# EAGLE schematic mod_mixer (EAGLE 7.2.0)
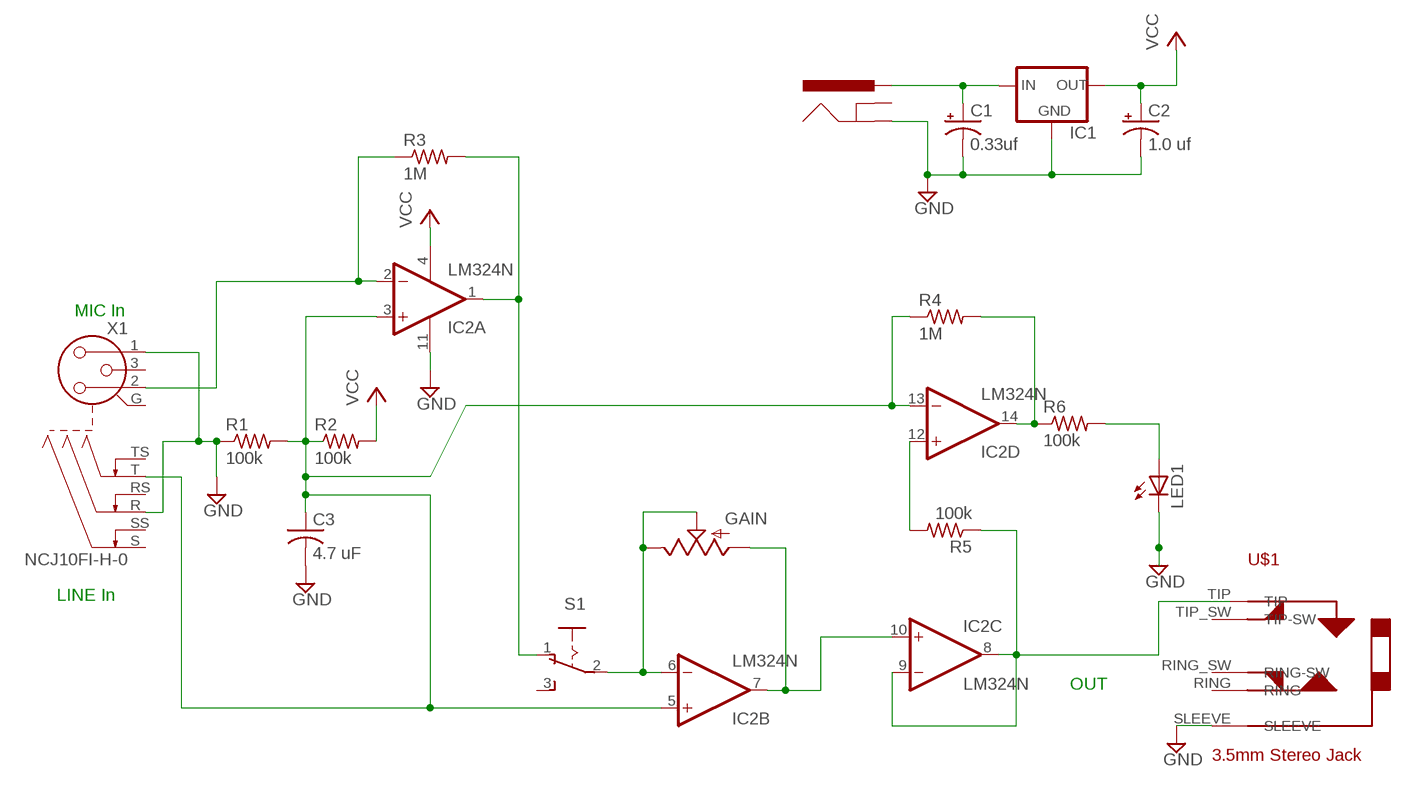
[diagram p0: schematic, sheet 1]

## Parts
C1  0.33uf  CPOL-USE2.5-6  [E2,5-6]
C2  1.0 uf  CPOL-USE2.5-6  [E2,5-6]
C3  4.7 uF  C-US050-030X075  [C050-030X075]
GAIN  POT  [ALPS_POT]
IC1  V_REG_78XXSIDE  [78XXL]
IC2  LM324N  [DIL14]
J1  POWER_JACKSLT  [POWER_JACK_SLOT]
LED1  LED3MM  [LED3MM]
R1  100k  R-US_0207/10  [0207/10]
R2  100k  R-US_0207/10  [0207/10]
R3  1M  R-US_0207/10  [0207/10]
R4  1M  R-US_0207/10  [0207/10]
R5  100k  R-US_0207/10  [0207/10]
R6  100k  R-US_0207/10  [0207/10]
S1  255SB  [255SB]
U$1  PICAXE_STEREOJACKSOCKET  [PICAXE_STEREOJACKSOCKET]
X1  NCJ10FI-H-0  [NCJ10FI-H-0]

## Nets
GND: C1.- C2.- C3.2 IC1.GND IC2.11(P:V-) J1.GND@2(GND) LED1.K(C) R1.1 U$1.SLEEVE X1.1 X1.R
N$1: C3.1 IC2.3(A:+IN) IC2.5(B:+IN) IC2.13(D:-IN) R1.2 R2.1 R4.1 X1.T
N$2: C1.+ IC1.IN J1.PWR
N$3: GAIN.P$3(A) IC2.7(B:OUT) IC2.10(C:+IN)
N$4: IC2.2(A:-IN) R3.1 X1.2
N$5: GAIN.P$1(E) GAIN.P$2(S) IC2.6(B:-IN) S1.2(P)
N$6: IC2.8(C:OUT) IC2.9(C:-IN) R5.1
N$7: IC2.1(A:OUT) R3.2 S1.1(O)
N$10: IC2.12(D:+IN) R5.2
N$11: IC2.14(D:OUT) R4.2 R6.1
N$13: LED1.A R6.2
VCC: C2.+ IC1.OUT IC2.4(P:V+) R2.2
Unconnected: J1.GND@1(GNDBREAK) S1.3(S) U$1.RING U$1.RING_SW(RING-SW) U$1.TIP U$1.TIP_SW(TIP-SW) X1.3 X1.G X1.RS X1.S X1.SS X1.TS

## Notes on the sheet
- MIC In
- LINE In
- OUT

## Library data of the parts
C1 C2 = rcl:CPOL-US: POLARIZED CAPACITOR, American symbol
C3 = resistor:C-US: CAPACITOR, American symbol
GAIN = SparkFun:POT
IC1 = SparkFun:V_REG_78XX: Voltage Regulator Standard 7805 5V regulator. IGO (Input Ground Output). Spark Fun Electronics SKU : COM-00107
IC2 = linear:LM324: OP AMP
J1 = SparkFun:POWER_JACK: Power Jack This is the standard 5.5mm barrel jack for power. The PTH is the most common, proven, reliable, footprint. All others are experimental. The Slot footprint only works if the mill layer is transmitted to the PCB fab house so be warned. Spark Fun Electronics SKU : PRT-00119. Mating wall wart : TOL-00298 (and others)
LED1 = led:LED: LED OSRAM: - CHIPLED LG R971, LG N971, LY N971, LG Q971, LY Q971, LO R971, LY R971 LH N974, LH R974 LS Q976, LO Q976, LY Q976 LO Q996 - Hyper CHIPLED LW Q18S LB Q993, LB Q99A, LB R99A - SideLED LS A670, LO A670, LY A670, LG A670, LP A670 LB A673, LV A673, LT A673, LW A673 LH A674 LY A675 LS A676, LA A676, LO A676, LY A676, LW A676 LS A679, LY A679, LG A679 - Hyper Micro SIDELED® LS Y876, LA Y876, LO Y876, LY Y876 LT Y87S - SmartLED LW L88C, LW L88S LB L89C, LB L89S, LG L890 LS L89K, LO L89K, LY L89K LS L896, LA L896, LO L896, LY L896 - TOPLED LS T670, LO T670, LY T670, LG T670, LP T670 LSG T670, LSP T670, LSY T670, LOP T670, LYG T670 LG T671, LOG T671, LSG T671 LB T673, LV T673, LT T673, LW T673 LH T674 LS T676, LA T676, LO T676, LY T676, LB T676, LH T676, LSB T676, LW T676 LB T67C, LV T67C, LT T67C, LS T67K, LO T67K, LY T67K, LW E67C LS E67B, LA E67B, LO E67B, LY E67B, LB E67C, LV E67C, LT E67C LW T67C LS T679, LY T679, LG T679 LS T770, LO T770, LY T770, LG T770, LP T770 LB T773, LV T773, LT T773, LW T773 LH T774 LS E675, LA E675, LY E675, LS T675 LS T776, LA T776, LO T776, LY T776, LB T776 LHGB T686 LT T68C, LB T68C - Hyper Mini TOPLED® LB M676 - Mini TOPLED Santana® LG M470 LS M47K, LO M47K, LY M47K Source: http://www.osram.convergy.de LUXEON: - LUMILED® LXK2-PW12-R00, LXK2-PW12-S00, LXK2-PW14-U00, LXK2-PW14-V00 LXK2-PM12-R00, LXK2-PM12-S00, LXK2-PM14-U00 LXK2-PE12-Q00, LXK2-PE12-R00, LXK2-PE12-S00, LXK2-PE14-T00, LXK2-PE14-U00 LXK2-PB12-K00, LXK2-PB12-L00, LXK2-PB12-M00, LXK2-PB14-N00, LXK2-PB14-P00, LXK2-PB14-Q00 LXK2-PR12-L00, LXK2-PR12-M00, LXK2-PR14-Q00, LXK2-PR14-R00 LXK2-PD12-Q00, LXK2-PD12-R00, LXK2-PD12-S00 LXK2-PH12-R00, LXK2-PH12-S00 LXK2-PL12-P00, LXK2-PL12-Q00, LXK2-PL12-R00 Source: www.luxeon.com KINGBRIGHT: KA-3528ASYC Source: www.kingbright.com
R1-R6 = resistor:R-US_: RESISTOR, American symbol
S1 = switch:255SB: SLIDING SWITCH Distributor Buerklin, 11G810
U$1 = StereoJackSocket:PICAXE_STEREOJACKSOCKET: Stereo 3.5mm jack
X1 = con-neutrik_ag:NCJ10FI-: Neutrik Audio Connector XLR SERIES Stereo 1/4" jack with switch Source: www.neutrik.com/; MPN: NCJ10FI-H-0; OC_FARNELL: unknown; OC_NEWARK: 99B1398